# Altium project DS1307.PrjPcb
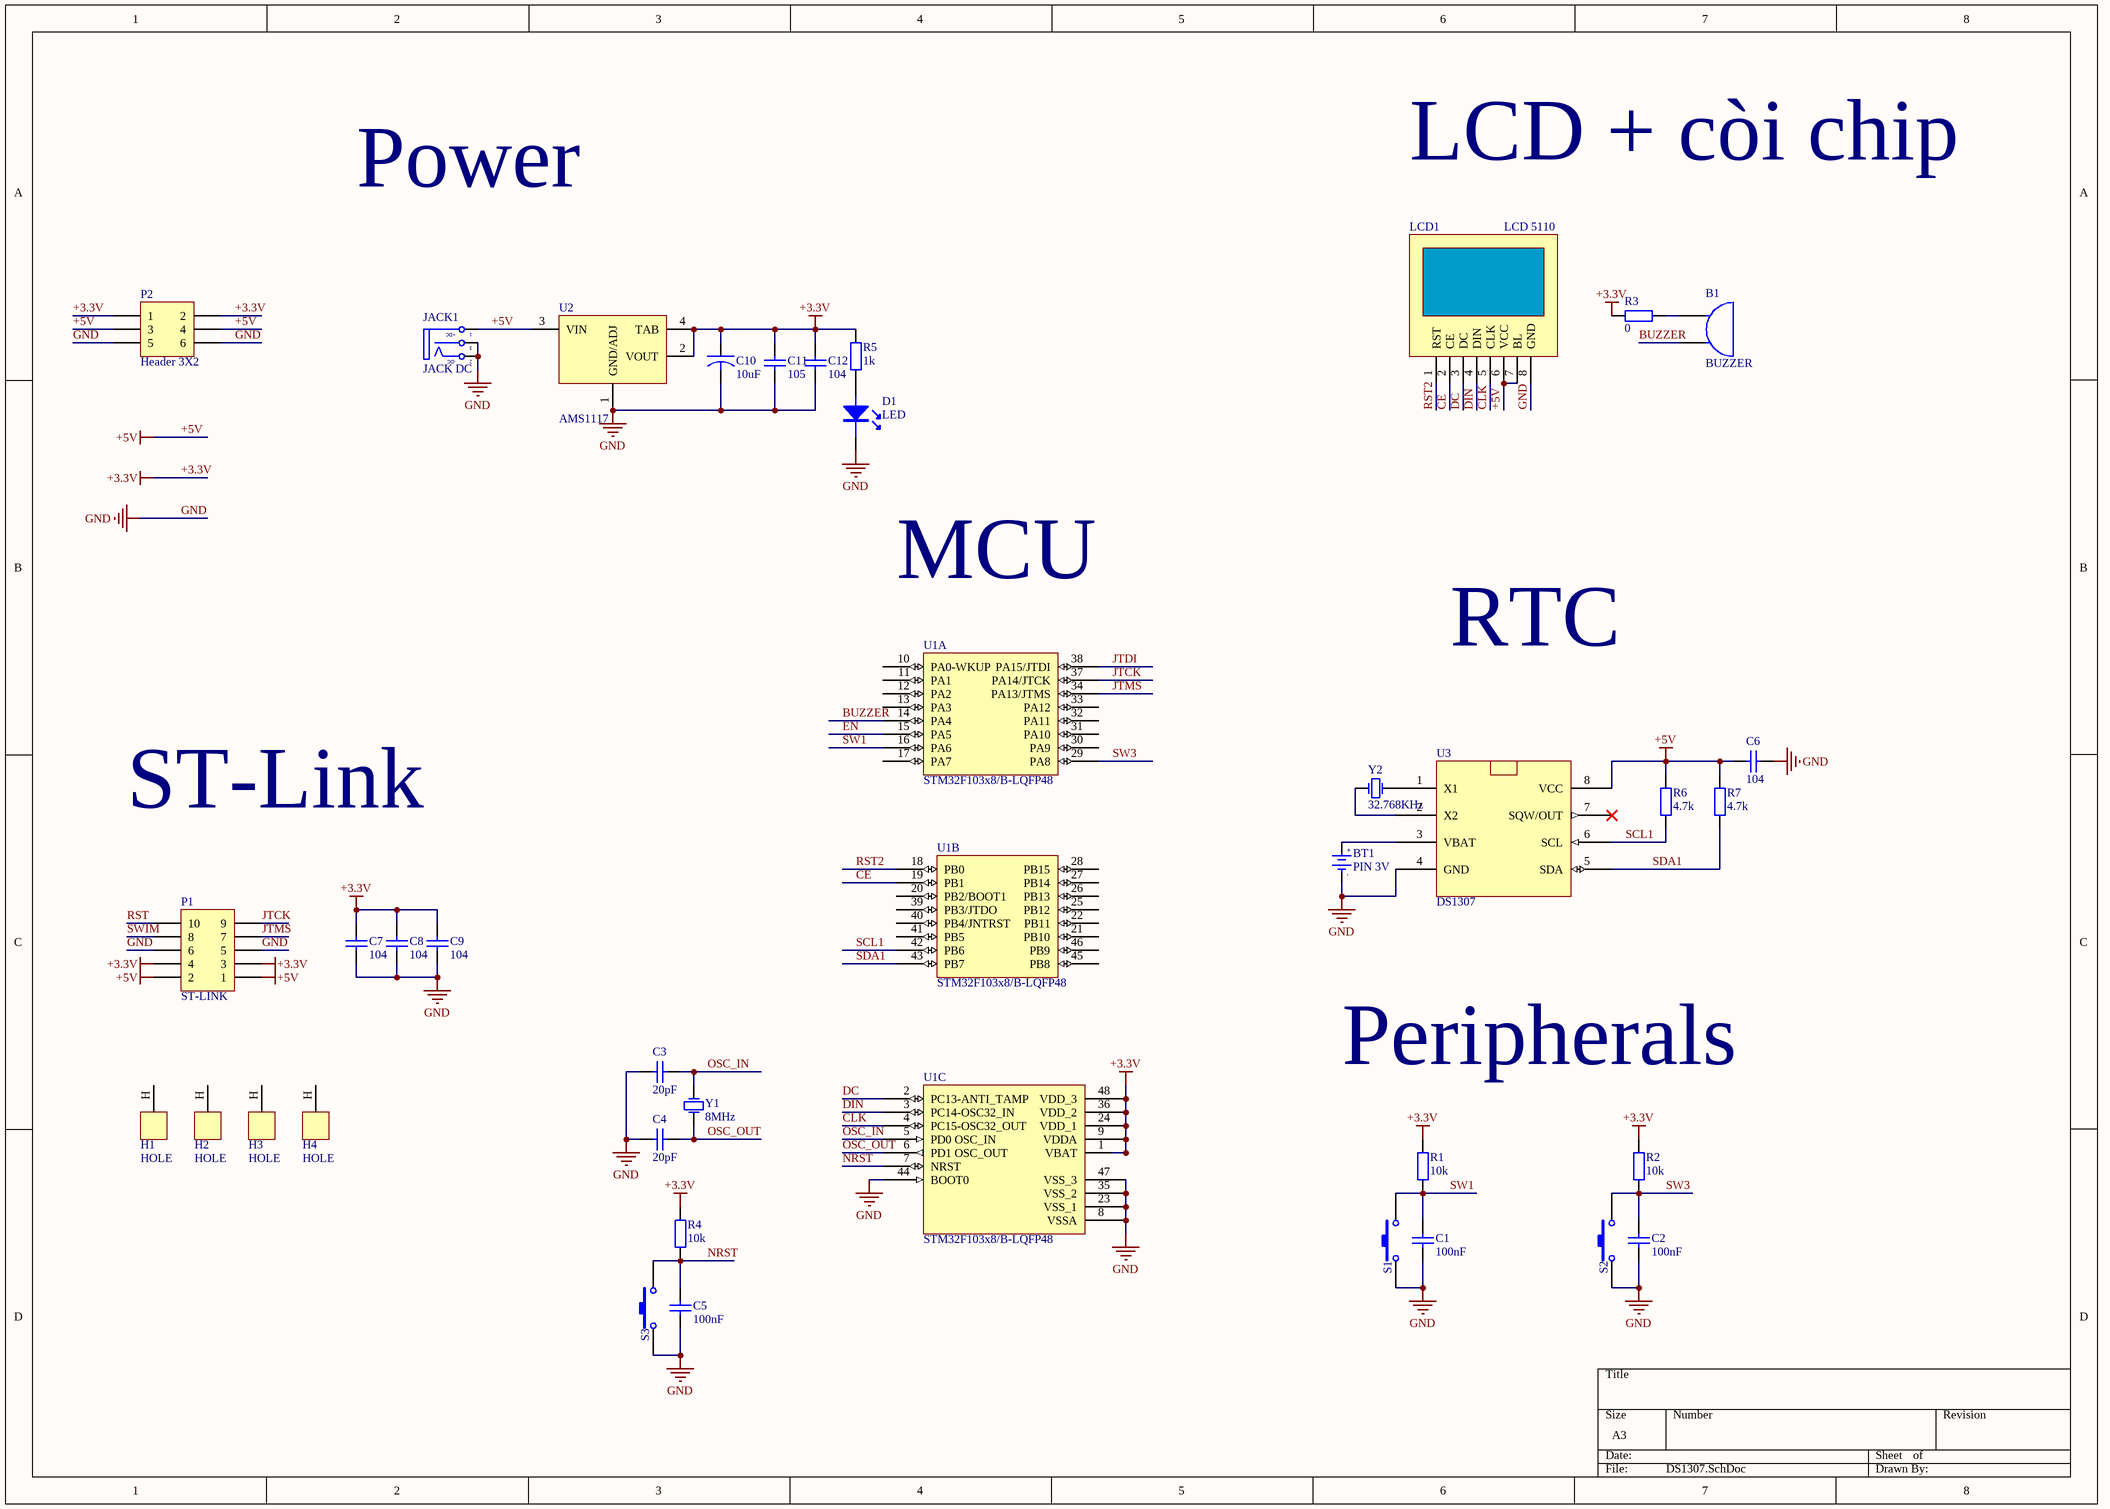
[diagram p0: DS1307.SchDoc]
1 sheet, 38 parts. Net scope: global (net labels, ports and power ports of the same name join across sheets).
Board file: DS1307.PcbDoc

## Sheet DS1307.SchDoc
size A3

### Parts
B1  BUZZER  [SPEAKER]
BT1  PIN 3V  [PIN3V]
C1  100nF  [0805 CAP]
C2  100nF  [0805 CAP]
C3  20pF  [0805 CAP]
C4  20pF  [0805 CAP]
C5  100nF  [0805 CAP]
C6  104  [0805 CAP]
C7  104  [0805 CAP]
C8  104  [0805 CAP]
C9  104  [0805 CAP]
C10  10uF  [CAPMP3216X16N]
C11  105  [0805 CAP]
C12  104  [0805 CAP]
D1  LED  [LED SMD 0805]
H1  HOLE  [HOLE]
H2  HOLE  [HOLE]
H3  HOLE  [HOLE]
H4  HOLE  [HOLE]
JACK1  JACK DC  [JACK DC]
LCD1  LCD 5110  [LCD 5110]
P1  ST-LINK  [IDC10 MALE]
P2  Header 3X2  [HDR2X3]
R1  10k  [0805 RESISTOR]
R2  10k  [0805 RESISTOR]
R3  0  [0805 RESISTOR]
R4  10k  [0805 RESISTOR]
R5  1k  [0805 RESISTOR]
R6  4.7k  [0805 RESISTOR]
R7  4.7k  [0805 RESISTOR]
S1  (no value)  [SW 4PIN]
S2  (no value)  [SW 4PIN]
S3  (no value)  [SW 4PIN]
U1  STM32F103x8/B-LQFP48  [LQFP 48 PIN]  (parts A,B,C of 3)
U2  AMS1117  [SOT223 - 3 LEAD]
U3  DS1307  [SOIC 8PIN]
Y1  8MHz  [CRYSTAL DIP]
Y2  32.768KHz  [XTAL 32kHz]

### Nets
+3.3V: C7.2 C8.2 C9.2 C10.1 C11.2 C12.2 P1.3 P1.4 P2.1 P2.2 R1.1 R2.1 R3.1 R4.1 R5.2 U1.1(VBAT) U1.9(VDDA) U1.24(VDD_1) U1.36(VDD_2) U1.48(VDD_3) U2.2(VOUT) U2.4(TAB)
+5V: C6.2 JACK1.1(T) LCD1.6(VCC) LCD1.7(BL) P1.1 P1.2 P2.3 P2.4 R6.2 R7.2 U2.3(VIN) U3.8(VCC)
GND: BT1.2(GND) C1.2 C2.2 C3.1 C4.1 C5.2 C6.1 C7.1 C8.1 C9.1 C10.2 C11.1 C12.1 D1.2 JACK1.2(TN) JACK1.3(S) LCD1.8(GND) P1.5 P1.6 P2.5 P2.6 S1.1 S2.1 S3.1 U1.8(VSSA) U1.23(VSS_1) U1.35(VSS_2) U1.44(BOOT0) U1.47(VSS_3) U2.1(GND/ADJ) U3.4(GND)
BUZZER: B1.2(B) U1.14(PA4)
CE: LCD1.2(CE) U1.19(PB1)
CLK: LCD1.5(CLK) U1.4(PC15-OSC32_OUT)
DC: LCD1.3(DC) U1.2(PC13-ANTI_TAMP)
DIN: LCD1.4(DIN) U1.3(PC14-OSC32_IN)
EN: U1.15(PA5)
JTCK: P1.9 U1.37(PA14/JTCK)
JTDI: U1.38(PA15/JTDI)
JTMS: P1.7 U1.34(PA13/JTMS)
NRST: C5.1 R4.2 S3.2 U1.7(NRST)
OSC_IN: C3.2 U1.5(PD0_OSC_IN) Y1.2(OSC2)
OSC_OUT: C4.2 U1.6(PD1_OSC_OUT) Y1.1(OSC1)
RST: P1.10
RST2: LCD1.1(RST) U1.18(PB0)
SCL1: R6.1 U1.42(PB6) U3.6(SCL)
SDA1: R7.1 U1.43(PB7) U3.5(SDA)
SW1: C1.1 R1.2 S1.2 U1.16(PA6)
SW3: C2.1 R2.2 S2.2 U1.29(PA8)
SWIM: P1.8
NetB1_1: B1.1(A) R3.2
NetBT1_1: BT1.1(+3V) U3.3(VBAT)
NetD1_1: D1.1 R5.1
NetU3_1: U3.1(X1) Y2.1(OSC1)
NetU3_2: U3.2(X2) Y2.2(OSC2)

Not connected (* = marked no-connect by the designer): H1 H(HOLE); H2 H(HOLE); H3 H(HOLE); H4 H(HOLE); U1 10(PA0-WKUP) 11(PA1) 12(PA2) 13(PA3) 17(PA7) 20(PB2/BOOT1) 21(PB10) 22(PB11) 25(PB12) 26(PB13) 27(PB14) 28(PB15) 30(PA9) 31(PA10) 32(PA11) 33(PA12) 39(PB3/JTDO) 40(PB4/JNTRST) 41(PB5) 45(PB8) 46(PB9); U3 7(SQW/OUT)*

### Notes on the sheet
- LCD + còi chip
- Power
- MCU
- RTC
- ST-Link
- Peripherals
- (in symbol JACK DC) +DC; -DC
- (in symbol PIN 3V) +; -

### Library data of the parts
C1-C9 C11 C12 = CAP CERAMIC: Published: 8-Jun-2000; LatestRevisionDate: 17-Jul-2002; LatestRevisionNote: Re-released for DXP Platform.; PackageReference: RAD-0.3; Publisher: Altium Limited
C10 = CAPACITOR
JACK1 = JACK DC: Value: Jac DC
P1 = Header 5X2: LatestRevisionDate: 17-Jul-2002; LatestRevisionNote: Re-released for DXP Platform.; Publisher: Altium Limited
R1-R7 = RESISTOR: Value: R1/4W - 1K
S1-S3 = SWITCH: Published: 24-Mar-1999; LatestRevisionDate: 17-Jul-2002; LatestRevisionNote: Re-released for DXP Platform.; PackageReference: SPST-2; Publisher: Altium Limited
Y1 Y2 = Crystal: Published: 8-Jun-2000; LatestRevisionDate: 17-Jul-2002; LatestRevisionNote: Re-released for DXP Platform.; PackageReference: R38; Publisher: Altium Limited
BT1 = PIN 3V: Value: PIN 3V
P2 = Header 3X2: LatestRevisionDate: 17-Jul-2002; LatestRevisionNote: Re-released for DXP Platform.; Publisher: Altium Limited
U1 = STM32F103x8/B-LQFP48: Published: 30-May-2008; DatasheetVersion: rev6, Mar-2008; PackageVersion: Mar-2008; PackageReference: LQFP48; Publisher: Altium Limited; PackageDescription: 48-Pin Low-Profile Quad Flat Pack, 7 x 7 mm Body, 0.5 mm Pitch (LQFP48); ComponentLink1Description: Manufacturer Link; ComponentLink1URL: www.st.com/stm32; ComponentLink2Description: Datasheet; ComponentLink2URL: http://www.st.com/stonline/products/literature/ds/13586.pdf